# Altium schematic sheet filter.SchDoc
size A4
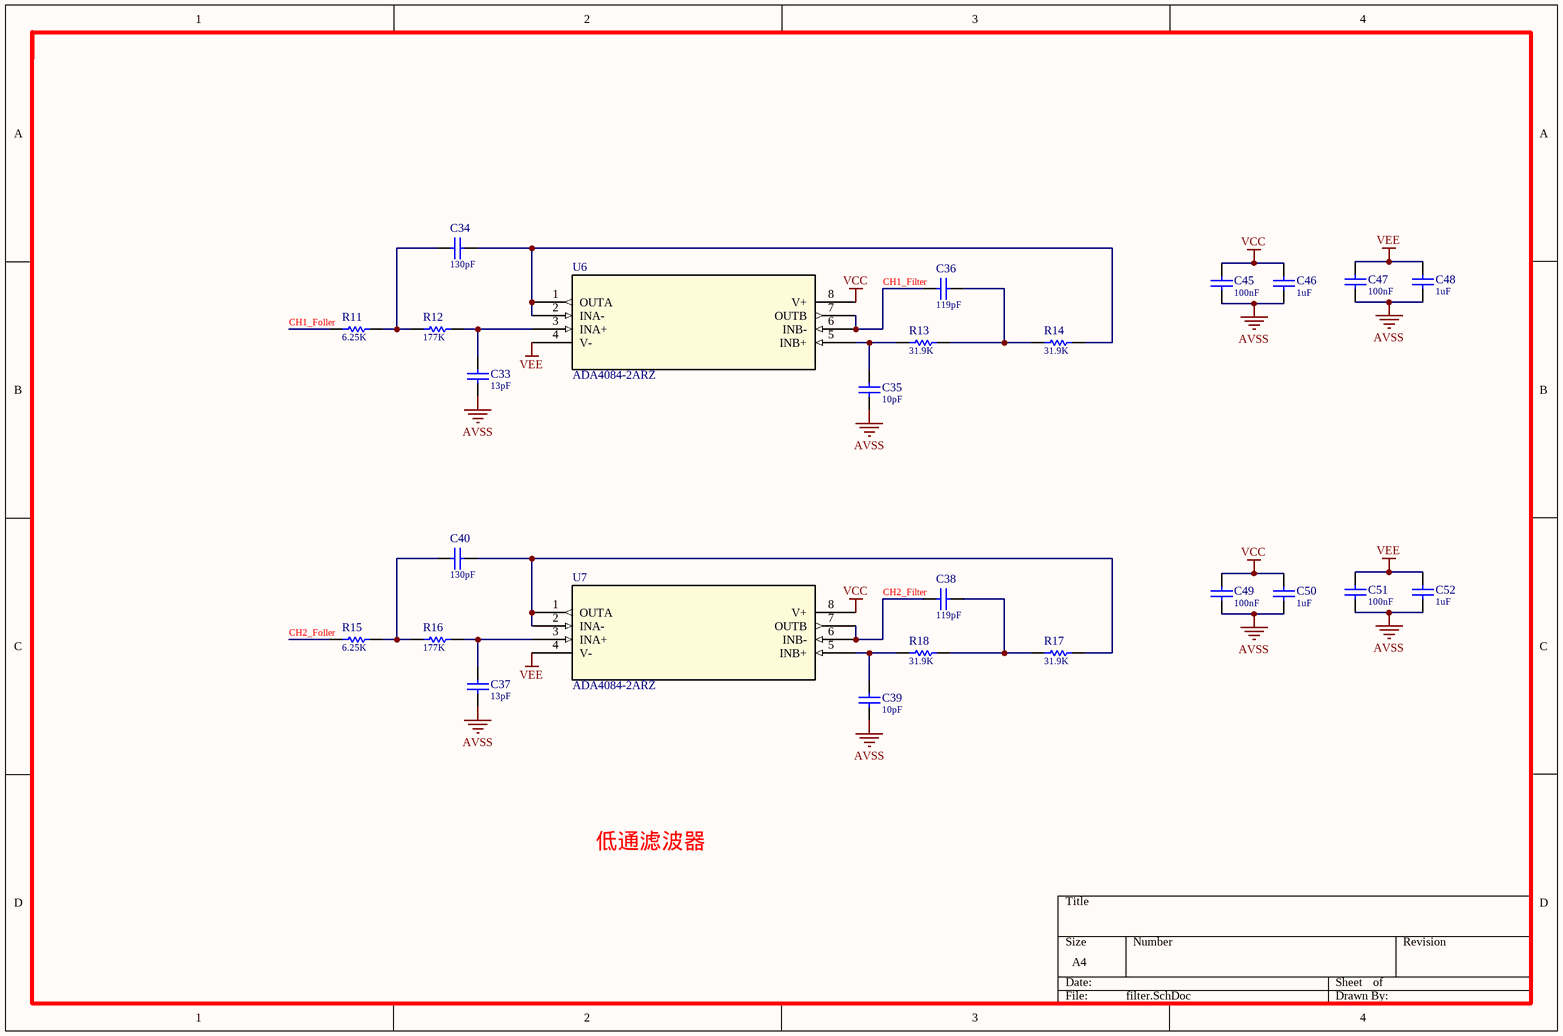
[diagram p0: filter.SchDoc]

## Parts
C33  value 13pF  [C0603-L]  (hidden comment: Cap-S)
C34  value 130pF  [C0603-L]  (hidden comment: Cap-S)
C35  value 10pF  [C0603-L]  (hidden comment: Cap-S)
C36  value 119pF  [C0603-L]  (hidden comment: Cap-S)
C37  value 13pF  [C0603-L]  (hidden comment: Cap-S)
C38  value 119pF  [C0603-L]  (hidden comment: Cap-S)
C39  value 10pF  [C0603-L]  (hidden comment: Cap-S)
C40  value 130pF  [C0603-L]  (hidden comment: Cap-S)
C45  value 100nF  [C0603-L]  (hidden comment: Cap-S)
C46  value 1uF  [C0603-L]  (hidden comment: Cap-S)
C47  value 100nF  [C0603-L]  (hidden comment: Cap-S)
C48  value 1uF  [C0603-L]  (hidden comment: Cap-S)
C49  value 100nF  [C0603-L]  (hidden comment: Cap-S)
C50  value 1uF  [C0603-L]  (hidden comment: Cap-S)
C51  value 100nF  [C0603-L]  (hidden comment: Cap-S)
C52  value 1uF  [C0603-L]  (hidden comment: Cap-S)
R11  value 6.25K  [R0603-L]  (hidden comment: R)
R12  value 177K  [R0603-L]  (hidden comment: R)
R13  value 31.9K  [R0603-L]  (hidden comment: R)
R14  value 31.9K  [R0603-L]  (hidden comment: R)
R15  value 6.25K  [R0603-L]  (hidden comment: R)
R16  value 177K  [R0603-L]  (hidden comment: R)
R17  value 31.9K  [R0603-L]  (hidden comment: R)
R18  value 31.9K  [R0603-L]  (hidden comment: R)
U6  ADA4084-2ARZ  [R_8_ADI]
U7  ADA4084-2ARZ  [R_8_ADI]

## Nets
AVSS: C33.1 C35.1 C37.1 C39.1 C45.1 C46.1 C47.1 C48.1 C49.1 C50.1 C51.1 C52.1
VCC: C45.2 C46.2 C49.2 C50.2 U6.8(V+) U7.8(V+)
VEE: C47.2 C48.2 C51.2 C52.2 U6.4(V-) U7.4(V-)
CH1_Filter: C36.2 U6.6(INB-) U6.7(OUTB)
CH1_Foller: R11.1
CH2_Filter: C38.2 U7.6(INB-) U7.7(OUTB)
CH2_Foller: R15.1
NetC33_2: C33.2 R12.2 U6.3(INA+)
NetC34_1: C34.1 R11.2 R12.1
NetC34_2: C34.2 R14.2 U6.1(OUTA) U6.2(INA-)
NetC35_2: C35.2 R13.1 U6.5(INB+)
NetC36_1: C36.1 R13.2 R14.1
NetC37_2: C37.2 R16.2 U7.3(INA+)
NetC38_1: C38.1 R17.1 R18.2
NetC39_2: C39.2 R18.1 U7.5(INB+)
NetC40_1: C40.1 R15.2 R16.1
NetC40_2: C40.2 R17.2 U7.1(OUTA) U7.2(INA-)

## Notes on the sheet
- 低通滤波器

## Library data of the parts
C33-C40 C45-C52 = Cap-S: 贴片瓷片电容
R11-R18 = Res: 贴片电阻
U6 U7 = ADA4084-2ARZ: No Description Available; Mfr_Name: Analog Devices Inc; Copyright: Copyright (C) 2021 Ultra Librarian. All rights reserved.; Manufacturer_Part_Number: ADA4084-2ARZ; RefDes: RefDes; Type: DEV